# EAGLE schematic esp8266-dimmer (EAGLE 7.5.0)
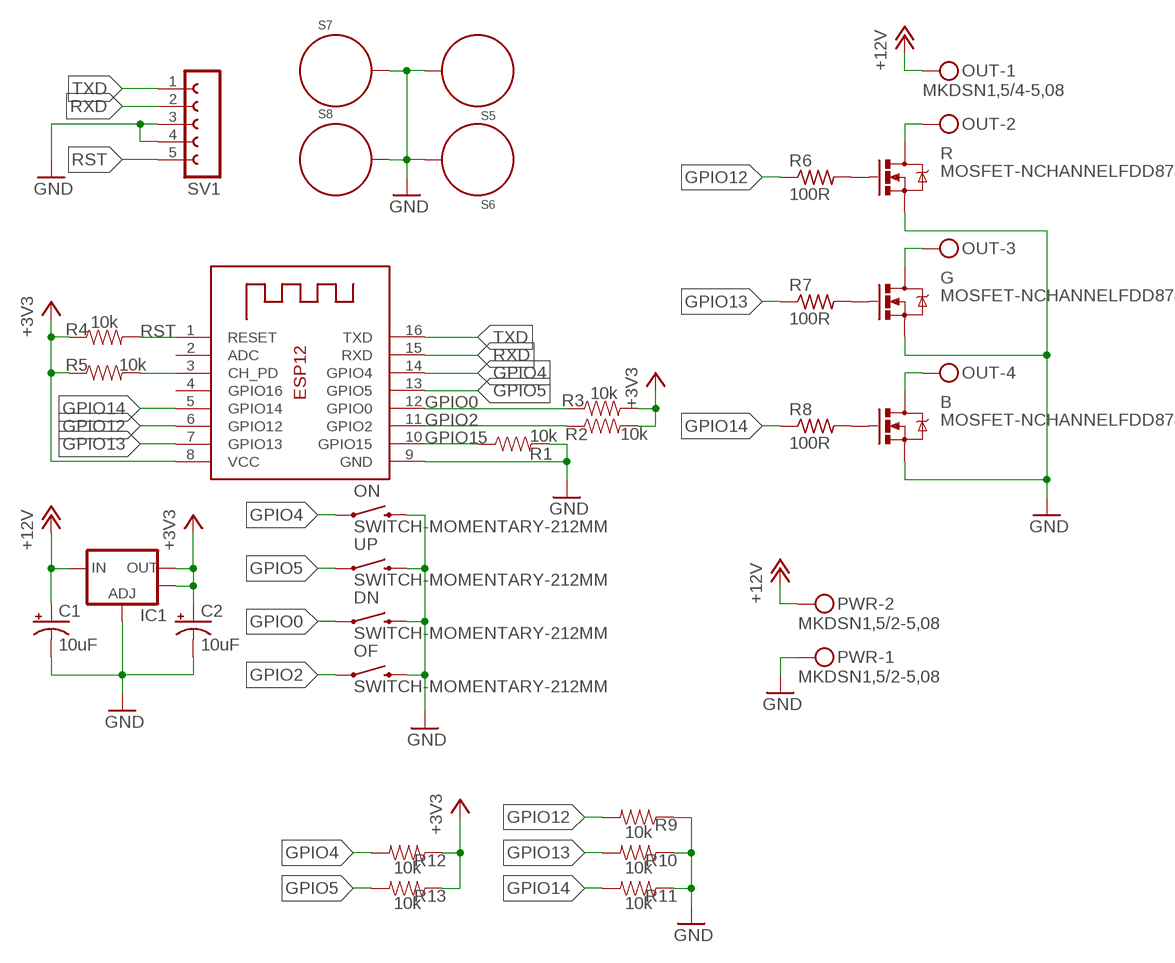
[diagram p0: schematic, sheet 1]

## Parts
B  MOSFET-NCHANNELFDD8780  [DPAK]
C1  10uF  CAP_POL1206-KIT  [EIA3216-KIT]
C2  10uF  CAP_POL1206-KIT  [EIA3216-KIT]
DN  SWITCH-MOMENTARY-212MM  [TACTILE-PTH-12MM]
ESP-12E  ESP-12  [ESP-12]
G  MOSFET-NCHANNELFDD8780  [DPAK]
IC1  V_REG_LM1117SOT223  [SOT223]
OF  SWITCH-MOMENTARY-212MM  [TACTILE-PTH-12MM]
ON  SWITCH-MOMENTARY-212MM  [TACTILE-PTH-12MM]
OUT  MKDSN1,5/4-5,08  [MKDSN1,5/4-5,08]
PWR  MKDSN1,5/2-5,08  [MKDSN1,5/2-5,08]
R  MOSFET-NCHANNELFDD8780  [DPAK]
R1  10k  RESISTOR0805-RES  [0805]
R2  10k  RESISTOR0805-RES  [0805]
R3  10k  RESISTOR0805-RES  [0805]
R4  10k  RESISTOR0805-RES  [0805]
R5  10k  RESISTOR0805-RES  [0805]
R6  100R  R-US_FLIPFLOP7  [0805-THM-7]
R7  100R  R-US_FLIPFLOP7  [0805-THM-7]
R8  100R  R-US_FLIPFLOP7  [0805-THM-7]
R9  10k  RESISTOR0805-RES  [0805]
R10  10k  RESISTOR0805-RES  [0805]
R11  10k  RESISTOR0805-RES  [0805]
R12  10k  RESISTOR0805-RES  [0805]
R13  10k  RESISTOR0805-RES  [0805]
S5  STANDOFF_ELECTRICAL  [STANDOFF-ELECTRICAL]
S6  STANDOFF_ELECTRICAL  [STANDOFF-ELECTRICAL]
S7  STANDOFF_ELECTRICAL  [STANDOFF-ELECTRICAL]
S8  STANDOFF_ELECTRICAL  [STANDOFF-ELECTRICAL]
SV1  FE05W  [FE05W]
UP  SWITCH-MOMENTARY-212MM  [TACTILE-PTH-12MM]

## Nets
+3V3: C2.A(+) ESP-12E.8(VCC) IC1.2(OUT) IC1.4(OUT) R2.2 R3.2 R4.1 R5.1 R12.1 R13.1
+12V: C1.A(+) IC1.3(IN) OUT.1 PWR.2
BOUT: B.4(D) OUT.4
GND: B.3(S) C1.C(-) C2.C(-) DN.3 ESP-12E.9(GND) G.3(S) IC1.1(ADJ) OF.3 ON.3 PWR.1 R1.2 R9.1 R10.1 R11.1 R.3(S) S5.P1 S6.P1 S7.P1 S8.P1 SV1.3 SV1.4 UP.3
GOUT: G.4(D) OUT.3
GPIO0: DN.1 ESP-12E.12(GPIO0) R3.1
GPIO2: ESP-12E.11(GPIO2) OF.1 R2.1
GPIO4: ESP-12E.14(GPIO4) ON.1 R12.2
GPIO5: ESP-12E.13(GPIO5) R13.2 UP.1
GPIO12: ESP-12E.6(GPIO12) R6.1 R9.2
GPIO13: ESP-12E.7(GPIO13) R7.1 R10.2
GPIO14: ESP-12E.5(GPIO14) R8.1 R11.2
GPIO15: ESP-12E.10(GPIO15) R1.1
N$2: B.1(G) R8.2
N$3: G.1(G) R7.2
N$4: R6.2 R.1(G)
N$5: ESP-12E.3(CH_PD) R5.2
ROUT: OUT.2 R.4(D)
RST: ESP-12E.1(RESET) R4.2 SV1.5
RXD: ESP-12E.15(RXD) SV1.2
TXD: ESP-12E.16(TXD) SV1.1
Unconnected: ESP-12E.2(ADC) ESP-12E.4(GPIO16)

## Library data of the parts
B G R = SparkFun-DiscreteSemi:MOSFET-NCHANNEL: Common NMOSFET Parts MFG P/N Store ID Prod ID FDD8780 TRANS-09984 SI7820DN TRANS-11055 FDS6630A IC-08089 2N7002PW TRANS-11151 FQP30N06L COM-10213 TRANS-10060 BSS123LT1G TRANS-08345 BSS138 TRANS-00830 BS170 2N7000; PROD_ID: TRANS-09984
C1 C2 = SparkFun-Passives:CAP_POL: Capacitor Polarized These are standard SMD and PTH capacitors. Normally 10uF, 47uF, and 100uF in electrolytic and tantalum varieties. Always verify the external diameter of the through hole cap, it varies with capacity, voltage, and manufacturer. The EIA devices should be standard.
DN OF ON UP = SparkFun-Electromechanical:SWITCH-MOMENTARY-2: Various NO switches- pushbuttons, reed, etc; PROD_ID: SWCH-09185
ESP-12E = adafruit66:ESP-12
IC1 = SparkFun-PowerIC:V_REG_LM1117: Voltage Regulator LM1117 Standard adjustable voltage regulator but in SMD form. Spark Fun Electronics SKU : COM-00595; PROD_ID: VREG-08170
OUT = con-phoenix-508:MKDSN1,5/4-5,08: MKDSN 1,5/ 4-5,08 Printklemme Nennstrom: 13,5 A Nennspannung: 250 V Rastermaß: 5,08 mm Polzahl: 4 Anschlussart: Schraubanschluss Montage: Löten Anschlussrichtung Leiter/Platine: 0 ° Artikelnummer: 1729144 Source: http://eshop.phoenixcontact.com .. 1729144.pdf
PWR = con-phoenix-508:MKDSN1,5/2-5,08: MKDSN 1,5/ 2-5,08 Printklemme Nennstrom: 13,5 A Nennspannung: 250 V Rastermaß: 5,08 mm Polzahl: 2 Anschlussart: Schraubanschluss Montage: Löten Anschlussrichtung Leiter/Platine: 0 ° Artikelnummer: 1729128 Source: http://eshop.phoenixcontact.com .. 1729128.pdf
R1-R5 R9-R13 = SparkFun-Resistors:RESISTOR: Resistor Basic schematic elements and footprints for 0603, 1206, and PTH resistors.
R6-R8 = adafruit66:R-US_: RESISTOR, American symbol
S5-S8 = SparkFun-Electromechanical:STANDOFF_ELECTRICAL: A standoff intended to be an electrically connected point. Pad size and stop size allow for a #4 Phillips pan screw head to make a solid connection to the board.
SV1 = con-lsta:FE05W: FEMALE HEADER; OC_FARNELL: unknown; OC_NEWARK: unknown